# Altium project Lora_pcb.PrjPcb
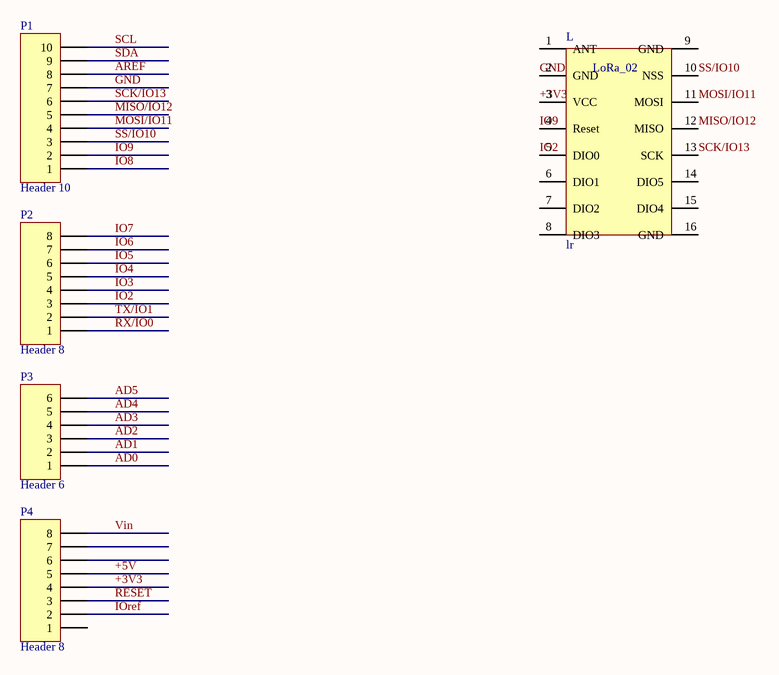
[diagram p0: Sheet1_lora.SchDoc]
1 sheet, 5 parts. Net scope: global (net labels, ports and power ports of the same name join across sheets).
Board file: PCB_lora.PcbDoc

## Sheet Sheet1_lora.SchDoc
size A4

### Parts
L  lr  [LoRa]
P1  Header 10  [HDR1X10]
P2  Header 8  [HDR1X8]
P3  Header 6  [HDR1X6]
P4  Header 8  [HDR1X8]

### Nets
+3V3: L.3(VCC) P4.4
+5V: P4.5
AD0: P3.1
AD1: P3.2
AD2: P3.3
AD3: P3.4
AD4: P3.5
AD5: P3.6
AREF: P1.8
GND: L.2(GND) P1.7
IO2: L.5(DIO0) P2.3
IO3: P2.4
IO4: P2.5
IO5: P2.6
IO6: P2.7
IO7: P2.8
IO8: P1.1
IO9: L.4(Reset) P1.2
IOref: P4.2
MISO/IO12: L.12(MISO) P1.5
MOSI/IO11: L.11(MOSI) P1.4
RESET: P4.3
RX/IO0: P2.1
SCK/IO13: L.13(SCK) P1.6
SCL: P1.10
SDA: P1.9
SS/IO10: L.10(NSS) P1.3
TX/IO1: P2.2
Vin: P4.8

Not connected (* = marked no-connect by the designer): L 1(ANT) 6(DIO1) 7(DIO2) 8(DIO3) 9(GND) 14(DIO5) 15(DIO4) 16(GND); P4 1 6 7

### Notes on the sheet
- (in symbol LoRa_Ra02) LoRa_02

### Library data of the parts
L = LoRa_Ra02
P1 = Header 10: Header, 10-Pin; LatestRevisionDate: 17-Jul-2002; LatestRevisionNote: Re-released for DXP Platform.; Publisher: Altium Limited
P2 P4 = Header 8: Header, 8-Pin; LatestRevisionDate: 17-Jul-2002; LatestRevisionNote: Re-released for DXP Platform.; Publisher: Altium Limited
P3 = Header 6: Header, 6-Pin; LatestRevisionDate: 17-Jul-2002; LatestRevisionNote: Re-released for DXP Platform.; Publisher: Altium Limited